# Altium schematic sheet RK3566_Ethernet.SchDoc
size A3; SheetNumber: 5; SheetTotal: 6
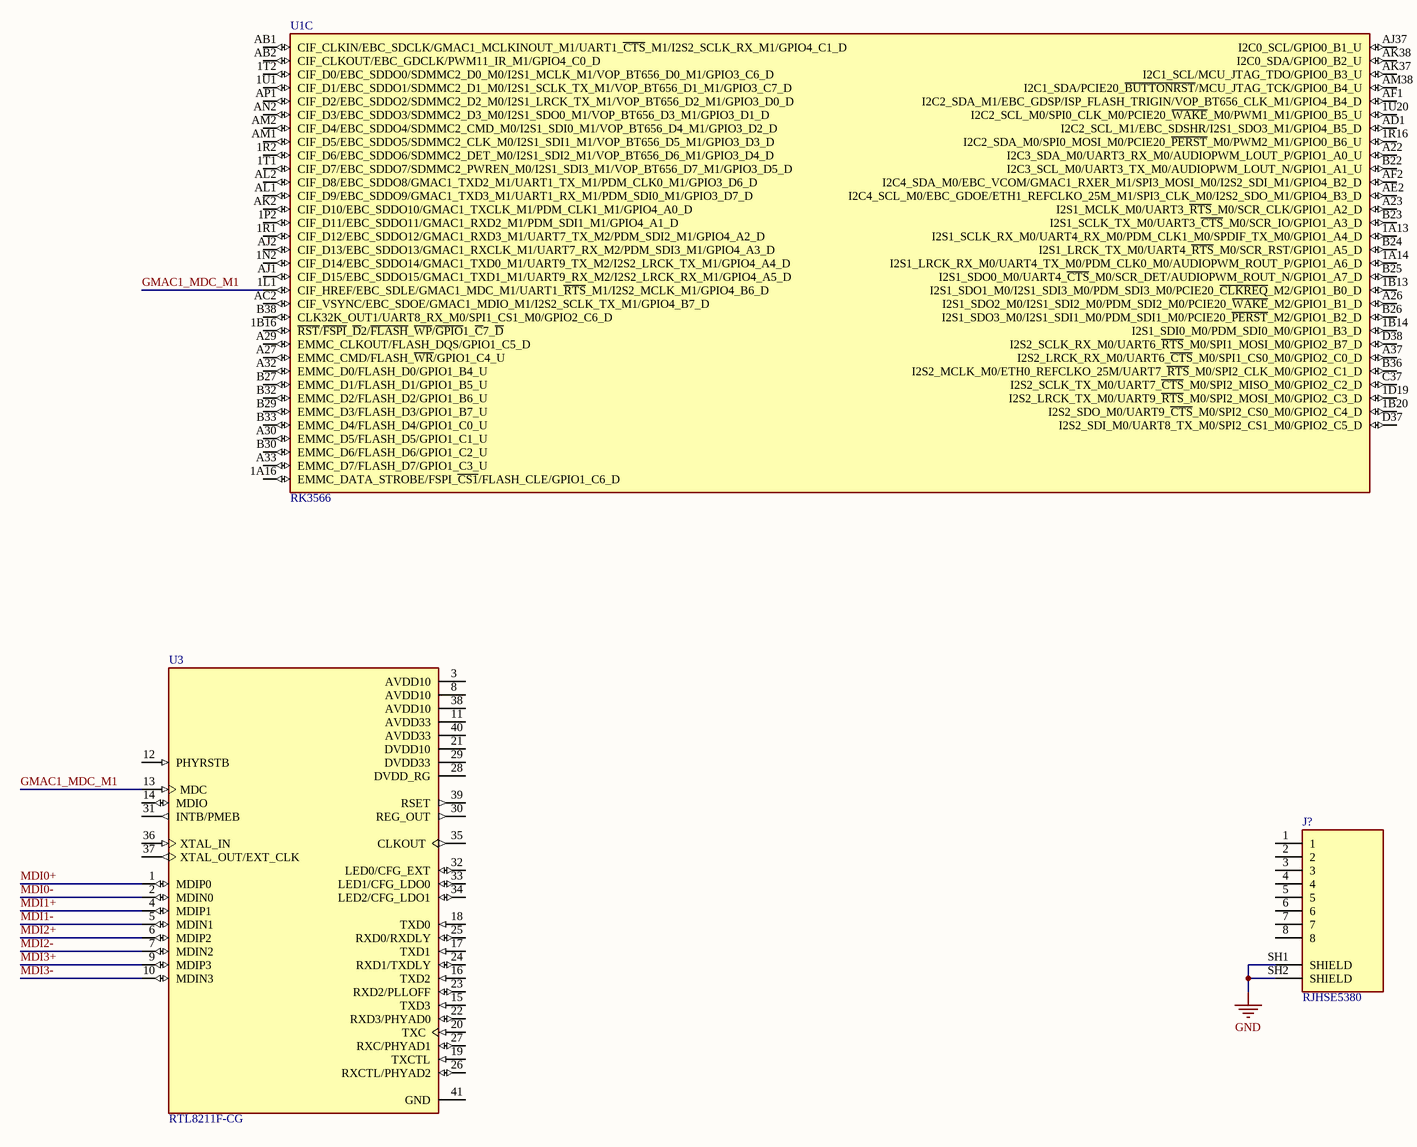
[diagram p0: RK3566_Ethernet.SchDoc]

## Parts
J?  RJHSE5380  [AMPHENOL_RJHSE5380]
U1  RK3566  [RK3566]  (part C of 9)
U3  RTL8211F-CG  [QFN40P500X500X90-41N]

## Nets
GND: J?.SH1(SHIELD) J?.SH2(SHIELD)
GMAC1_MDC_M1: U1.1L1(CIF_HREF/EBC_SDLE/GMAC1_MDC_M1/UART1_~{RTS}_M1/I2S2_MCLK_M1/GPIO4_B6_D) U3.13(MDC)
MDI0+: U3.1(MDIP0)
MDI0-: U3.2(MDIN0)
MDI1+: U3.4(MDIP1)
MDI1-: U3.5(MDIN1)
MDI2+: U3.6(MDIP2)
MDI2-: U3.7(MDIN2)
MDI3+: U3.9(MDIP3)
MDI3-: U3.10(MDIN3)

Not connected (* = marked no-connect by the designer): J? 1 2 3 4 5 6 7 8; U1 1A13(I2S1_SCLK_RX_M0/UART4_RX_M0/PDM_CLK1_M0/SPDIF_TX_M0/GPIO1_A4_D) 1A14(I2S1_LRCK_RX_M0/UART4_TX_M0/PDM_CLK0_M0/AUDIOPWM_ROUT_P/GPIO1_A6_D) 1A16(EMMC_DATA_STROBE/FSPI_~{CS1}/FLASH_CLE/GPIO1_C6_D) 1B13(I2S1_SDO1_M0/I2S1_SDI3_M0/PDM_SDI3_M0/PCIE20_~{CLKREQ}_M2/GPIO1_B0_D) 1B14(I2S1_SDI0_M0/PDM_SDI0_M0/GPIO1_B3_D) 1B16(~{RST}/~{FSPI}_~{D}2/~{FLASH}_~{WP}/~{GPIO}1_~{C}7_~{D}) 1B20(I2S2_SDO_M0/UART9_~{CTS}_M0/SPI2_CS0_M0/GPIO2_C4_D) 1D19(I2S2_LRCK_TX_M0/UART9_~{RTS}_M0/SPI2_MOSI_M0/GPIO2_C3_D) 1N2(CIF_D14/EBC_SDDO14/GMAC1_TXD0_M1/UART9_TX_M2/I2S2_LRCK_TX_M1/GPIO4_A4_D) 1P2(CIF_D11/EBC_SDDO11/GMAC1_RXD2_M1/PDM_SDI1_M1/GPIO4_A1_D) 1R1(CIF_D12/EBC_SDDO12/GMAC1_RXD3_M1/UART7_TX_M2/PDM_SDI2_M1/GPIO4_A2_D) 1R2(CIF_D6/EBC_SDDO6/SDMMC2_DET_M0/I2S1_SDI2_M1/VOP_BT656_D6_M1/GPIO3_D4_D) 1R16(I2C2_SDA_M0/SPI0_MOSI_M0/PCIE20_~{PERST}_M0/PWM2_M1/GPIO0_B6_U) 1T1(CIF_D7/EBC_SDDO7/SDMMC2_PWREN_M0/I2S1_SDI3_M1/VOP_BT656_D7_M1/GPIO3_D5_D) 1T2(CIF_D0/EBC_SDDO0/SDMMC2_D0_M0/I2S1_MCLK_M1/VOP_BT656_D0_M1/GPIO3_C6_D) 1U1(CIF_D1/EBC_SDDO1/SDMMC2_D1_M0/I2S1_SCLK_TX_M1/VOP_BT656_D1_M1/GPIO3_C7_D) 1U20(I2C2_SCL_M0/SPI0_CLK_M0/PCIE20_~{WAKE}_M0/PWM1_M1/GPIO0_B5_U) A22(I2C3_SDA_M0/UART3_RX_M0/AUDIOPWM_LOUT_P/GPIO1_A0_U) A23(I2S1_MCLK_M0/UART3_~{RTS}_M0/SCR_CLK/GPIO1_A2_D) A26(I2S1_SDO2_M0/I2S1_SDI2_M0/PDM_SDI2_M0/PCIE20_~{WAKE}_M2/GPIO1_B1_D) A27(EMMC_CMD/FLASH_~{WR}/GPIO1_C4_U) A29(EMMC_CLKOUT/FLASH_DQS/GPIO1_C5_D) A30(EMMC_D5/FLASH_D5/GPIO1_C1_U) A32(EMMC_D0/FLASH_D0/GPIO1_B4_U) A33(EMMC_D7/FLASH_D7/GPIO1_C3_U) A37(I2S2_LRCK_RX_M0/UART6_~{CTS}_M0/SPI1_CS0_M0/GPIO2_C0_D) AB1(CIF_CLKIN/EBC_SDCLK/GMAC1_MCLKINOUT_M1/UART1_~{CTS}_M1/I2S2_SCLK_RX_M1/GPIO4_C1_D) AB2(CIF_CLKOUT/EBC_GDCLK/PWM11_IR_M1/GPIO4_C0_D) AC2(CIF_VSYNC/EBC_SDOE/GMAC1_MDIO_M1/I2S2_SCLK_TX_M1/GPIO4_B7_D) AD1(I2C2_SCL_M1/EBC_SDSHR/I2S1_SDO3_M1/GPIO4_B5_D) AE2(I2C4_SCL_M0/EBC_GDOE/ETH1_REFCLKO_25M_M1/SPI3_CLK_M0/I2S2_SDO_M1/GPIO4_B3_D) AF1(I2C2_SDA_M1/EBC_GDSP/ISP_FLASH_TRIGIN/VOP_BT656_CLK_M1/GPIO4_B4_D) AF2(I2C4_SDA_M0/EBC_VCOM/GMAC1_RXER_M1/SPI3_MOSI_M0/I2S2_SDI_M1/GPIO4_B2_D) AJ1(CIF_D15/EBC_SDDO15/GMAC1_TXD1_M1/UART9_RX_M2/I2S2_LRCK_RX_M1/GPIO4_A5_D) AJ2(CIF_D13/EBC_SDDO13/GMAC1_RXCLK_M1/UART7_RX_M2/PDM_SDI3_M1/GPIO4_A3_D) AJ37(I2C0_SCL/GPIO0_B1_U) AK2(CIF_D10/EBC_SDDO10/GMAC1_TXCLK_M1/PDM_CLK1_M1/GPIO4_A0_D) AK37(I2C1_SCL/MCU_JTAG_TDO/GPIO0_B3_U) AK38(I2C0_SDA/GPIO0_B2_U) AL1(CIF_D9/EBC_SDDO9/GMAC1_TXD3_M1/UART1_RX_M1/PDM_SDI0_M1/GPIO3_D7_D) AL2(CIF_D8/EBC_SDDO8/GMAC1_TXD2_M1/UART1_TX_M1/PDM_CLK0_M1/GPIO3_D6_D) AM1(CIF_D5/EBC_SDDO5/SDMMC2_CLK_M0/I2S1_SDI1_M1/VOP_BT656_D5_M1/GPIO3_D3_D) AM2(CIF_D4/EBC_SDDO4/SDMMC2_CMD_M0/I2S1_SDI0_M1/VOP_BT656_D4_M1/GPIO3_D2_D) AM38(I2C1_SDA/PCIE20_~{BUTTONRST}/MCU_JTAG_TCK/GPIO0_B4_U) AN2(CIF_D3/EBC_SDDO3/SDMMC2_D3_M0/I2S1_SDO0_M1/VOP_BT656_D3_M1/GPIO3_D1_D) AP1(CIF_D2/EBC_SDDO2/SDMMC2_D2_M0/I2S1_LRCK_TX_M1/VOP_BT656_D2_M1/GPIO3_D0_D) B22(I2C3_SCL_M0/UART3_TX_M0/AUDIOPWM_LOUT_N/GPIO1_A1_U) B23(I2S1_SCLK_TX_M0/UART3_~{CTS}_M0/SCR_IO/GPIO1_A3_D) B24(I2S1_LRCK_TX_M0/UART4_~{RTS}_M0/SCR_RST/GPIO1_A5_D) B25(I2S1_SDO0_M0/UART4_~{CTS}_M0/SCR_DET/AUDIOPWM_ROUT_N/GPIO1_A7_D) B26(I2S1_SDO3_M0/I2S1_SDI1_M0/PDM_SDI1_M0/PCIE20_~{PERST}_M2/GPIO1_B2_D) B27(EMMC_D1/FLASH_D1/GPIO1_B5_U) B29(EMMC_D3/FLASH_D3/GPIO1_B7_U) B30(EMMC_D6/FLASH_D6/GPIO1_C2_U) B32(EMMC_D2/FLASH_D2/GPIO1_B6_U) B33(EMMC_D4/FLASH_D4/GPIO1_C0_U) B36(I2S2_MCLK_M0/ETH0_REFCLKO_25M/UART7_~{RTS}_M0/SPI2_CLK_M0/GPIO2_C1_D) B38(CLK32K_OUT1/UART8_RX_M0/SPI1_CS1_M0/GPIO2_C6_D) C37(I2S2_SCLK_TX_M0/UART7_~{CTS}_M0/SPI2_MISO_M0/GPIO2_C2_D) D37(I2S2_SDI_M0/UART8_TX_M0/SPI2_CS1_M0/GPIO2_C5_D) D38(I2S2_SCLK_RX_M0/UART6_~{RTS}_M0/SPI1_MOSI_M0/GPIO2_B7_D); U3 3(AVDD10) 8(AVDD10) 11(AVDD33) 12(PHYRSTB) 14(MDIO) 15(TXD3) 16(TXD2) 17(TXD1) 18(TXD0) 19(TXCTL) 20(TXC) 21(DVDD10) 22(RXD3/PHYAD0) 23(RXD2/PLLOFF) 24(RXD1/TXDLY) 25(RXD0/RXDLY) 26(RXCTL/PHYAD2) 27(RXC/PHYAD1) 28(DVDD_RG) 29(DVDD33) 30(REG_OUT) 31(INTB/PMEB) 32(LED0/CFG_EXT) 33(LED1/CFG_LDO0) 34(LED2/CFG_LDO1) 35(CLKOUT) 36(XTAL_IN) 37(XTAL_OUT/EXT_CLK) 38(AVDD10) 39(RSET) 40(AVDD33) 41(GND)

## Library data of the parts
J? = RJHSE5380: MF: Amphenol; Package: None; Price: None; Value: *; MP: RJHSE5380; Availability: Unavailable
U1 = RK3566: high-performance and low-power quad-core application processor; MF: Fuzhou Rockchip Electronics Co; SnapEDA_Link: https://www.snapeda.com/parts/RK3566/Fuzhou+Rockchip+Electronics+Co/view-part/?ref=snap; Package: None; Value: *; MP: RK3566; Check_prices: https://www.snapeda.com/parts/RK3566/Fuzhou+Rockchip+Electronics+Co/view-part/?ref=eda
U3 = RTL8211F-CG: GbE PHY with RGMIII interface & EEE feature (Switch Regulator), QFN40; MF: Realtek Semiconductor Corp; SnapEDA_Link: https://www.snapeda.com/parts/RTL8211F-CG/Realtek/view-part/?ref=snap; Package: None; Value: *; MP: RTL8211F-CG; Check_prices: https://www.snapeda.com/parts/RTL8211F-CG/Realtek/view-part/?ref=eda